# Altium schematic sheet DRIVERS_CONNECTORS.SchDoc: LEDBO - LRTBR98G (Drivers)
size B; Author: Sébastien Gélinas; Organization: SmartHalo; Address1: 5445 de Gaspé; Address2: Montréal, QC; Address3: Canada; Address4: H2T 3B2; Revision: 1; SheetNumber: 1; SheetTotal: 5
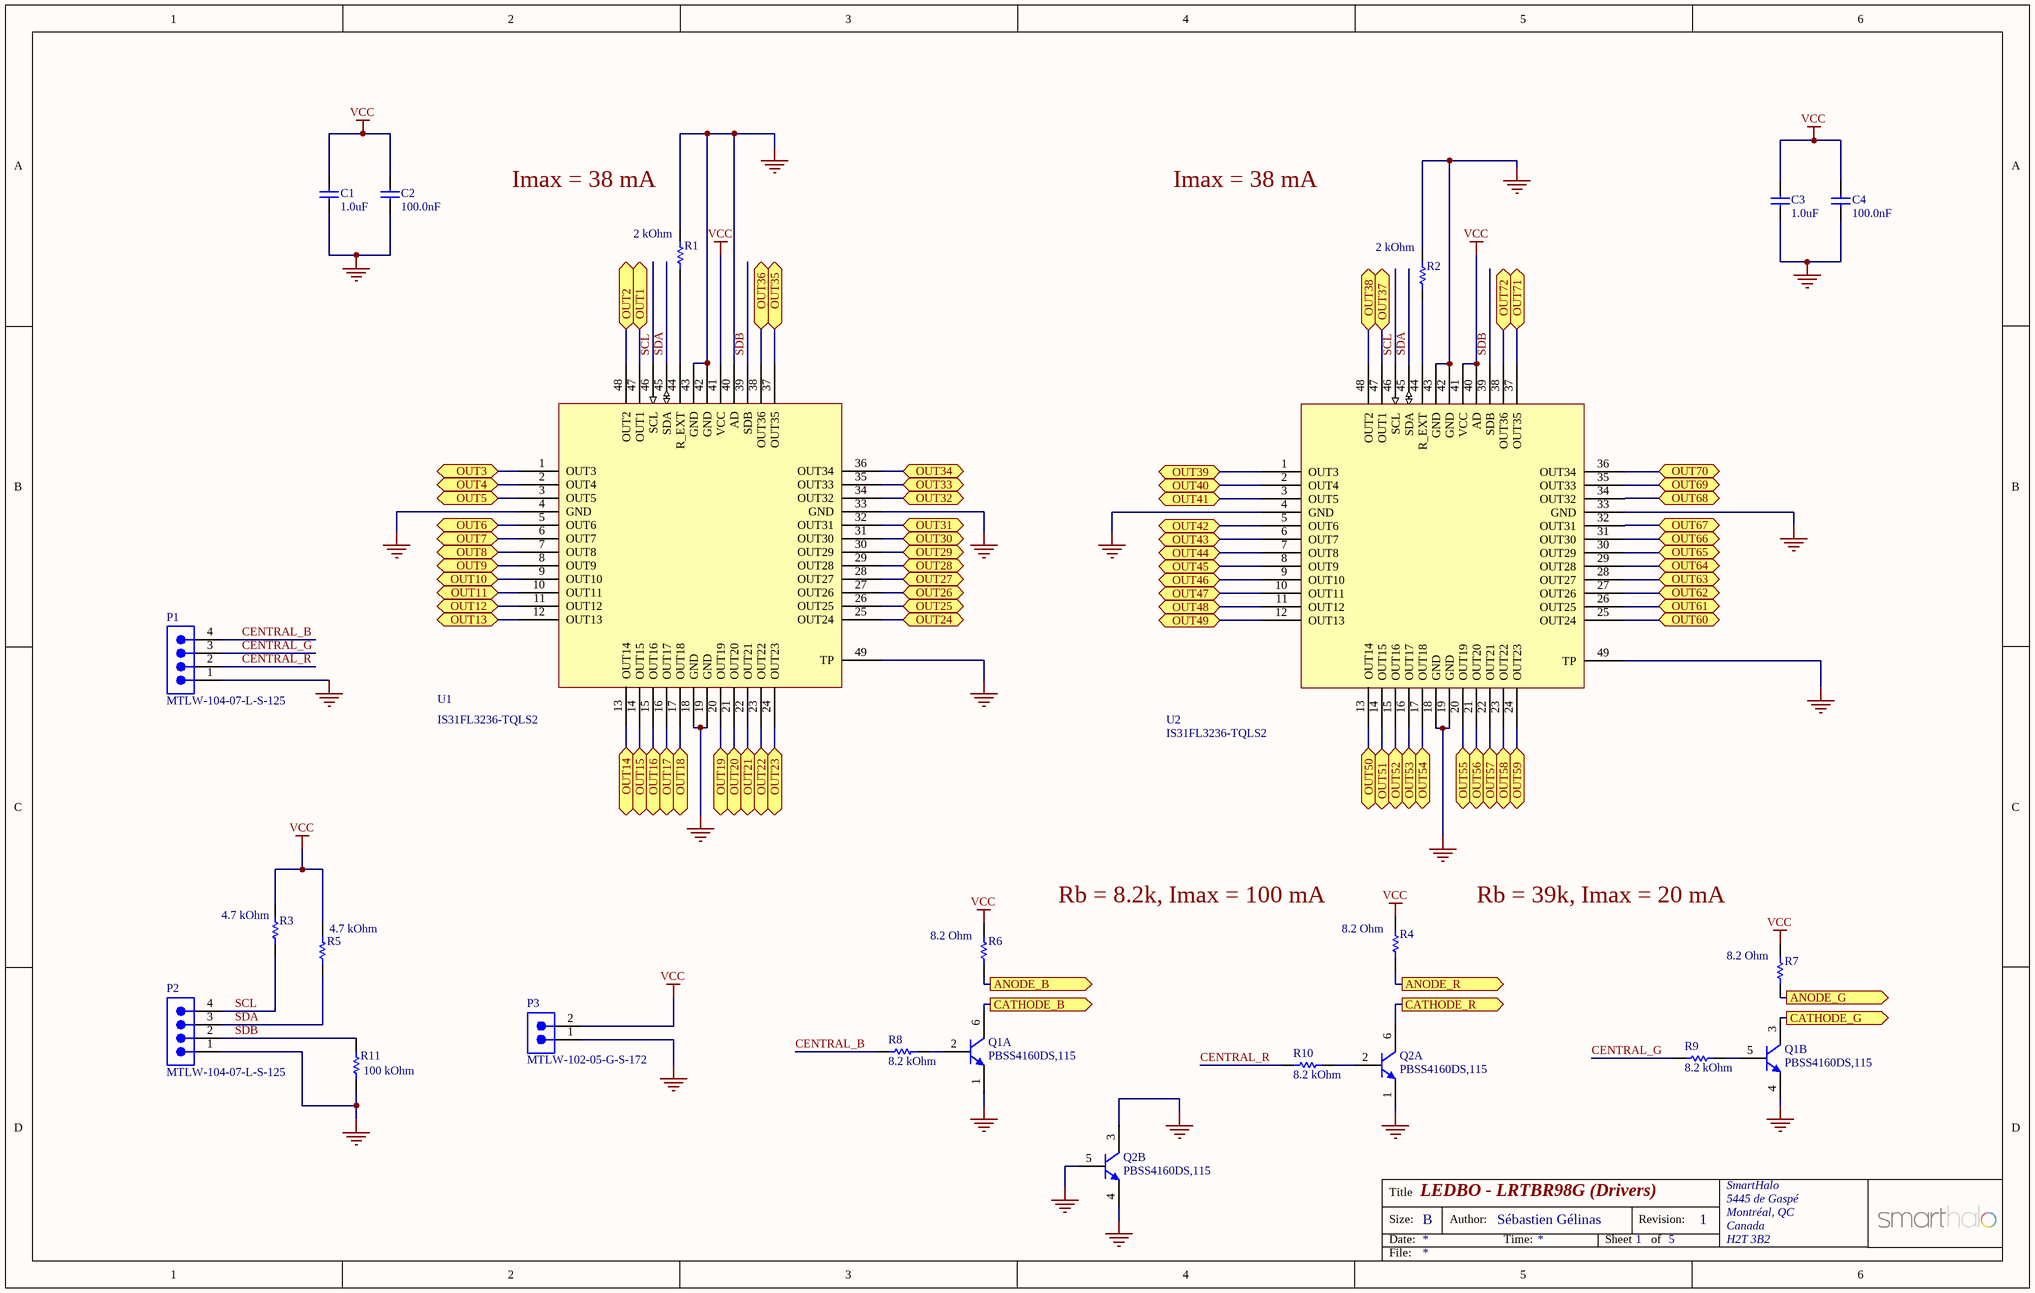
[diagram p0: DRIVERS_CONNECTORS.SchDoc]

## Parts
C1  1.0uF  [CAPC0603(1608)100_N]
C2  100.0nF  [CAPC0603(1608)100_N]
C3  1.0uF  [CAPC0603(1608)100_N]
C4  100.0nF  [CAPC0603(1608)100_N]
P1  MTLW-104-07-L-S-125  [SMTC-MTLW-104-07-X-S-125]  (no BOM)
P2  MTLW-104-07-L-S-125  [SMTC-MTLW-104-07-X-S-125]  (no BOM)
P3  MTLW-102-05-G-S-172  [SMTC-MTLW-102-05-X-S-172]  (no BOM)
Q1  PBSS4160DS,115  [NXP-SC74_M]  (parts A,B of 2)
Q2  PBSS4160DS,115  [NXP-SC74_M]  (parts A,B of 2)
R1  2 kOhm  [RESC0603(1608)_N]
R2  2 kOhm  [RESC0603(1608)_N]
R3  4.7 kOhm  [RESC0603(1608)_N]
R4  8.2 Ohm  [RESC0603(1608)_N]
R5  4.7 kOhm  [RESC0603(1608)_N]
R6  8.2 Ohm  [RESC0603(1608)_N]
R7  8.2 Ohm  [RESC0603(1608)_N]
R8  8.2 kOhm  [RESC0603(1608)_N]
R9  8.2 kOhm  [RESC0603(1608)_N]
R10  8.2 kOhm  [RESC0603(1608)_N]
R11  100 kOhm  [RESC0603(1608)_N]
U1  IS31FL3236-TQLS2  [TQFP48]
U2  IS31FL3236-TQLS2  [TQFP48]

## Ports
ANODE_B (out), ANODE_G (out), ANODE_R (out), CATHODE_B (out), CATHODE_G (out), CATHODE_R (out), OUT1, OUT2, OUT3, OUT4, OUT5, OUT6, OUT7, OUT8, OUT9, OUT10, OUT11, OUT12, OUT13, OUT14, OUT15, OUT16, OUT17, OUT18, OUT19, OUT20, OUT21, OUT22, OUT23, OUT24, OUT25, OUT26, OUT27, OUT28, OUT29, OUT30, OUT31, OUT32, OUT33, OUT34, OUT35, OUT36, OUT37, OUT38, OUT39, OUT40, OUT41, OUT42, OUT43, OUT44, OUT45, OUT46, OUT47, OUT48, OUT49, OUT50, OUT51, OUT52, OUT53, OUT54, OUT55, OUT56, OUT57, OUT58, OUT59, OUT60, OUT61, OUT62, OUT63, OUT64, OUT65, OUT66, OUT67, OUT68, OUT69, OUT70, OUT71, OUT72

## Nets
GND: C1.2 C2.2 C3.2 C4.2 P1.1 P2.1 P3.1 Q1.1(E1) Q1.4(E2) Q2.1(E1) Q2.3(C2) Q2.4(E2) Q2.5(B2) R1.2 R2.2 R11.1 U1.4(GND) U1.18(GND) U1.19(GND) U1.33(GND) U1.40(AD) U1.42(GND) U1.43(GND) U1.49(TP) U2.4(GND) U2.18(GND) U2.19(GND) U2.33(GND) U2.42(GND) U2.43(GND) U2.49(TP)
VCC: C1.1 C2.1 C3.1 C4.1 P3.2 R3.2 R4.2 R5.2 R6.2 R7.2 U1.41(VCC) U2.40(AD) U2.41(VCC)
ANODE_B: R6.1 ; port ANODE_B
ANODE_G: R7.1 ; port ANODE_G
ANODE_R: R4.1 ; port ANODE_R
CATHODE_B: Q1.6(C1) ; port CATHODE_B
CATHODE_G: Q1.3(C2) ; port CATHODE_G
CATHODE_R: Q2.6(C1) ; port CATHODE_R
CENTRAL_B: P1.4 R8.2
CENTRAL_G: P1.3 R9.2
CENTRAL_R: P1.2 R10.2
OUT1: U1.47(OUT1) ; port OUT1
OUT2: U1.48(OUT2) ; port OUT2
OUT3: U1.1(OUT3) ; port OUT3
OUT4: U1.2(OUT4) ; port OUT4
OUT5: U1.3(OUT5) ; port OUT5
OUT6: U1.5(OUT6) ; port OUT6
OUT7: U1.6(OUT7) ; port OUT7
OUT8: U1.7(OUT8) ; port OUT8
OUT9: U1.8(OUT9) ; port OUT9
OUT10: U1.9(OUT10) ; port OUT10
OUT11: U1.10(OUT11) ; port OUT11
OUT12: U1.11(OUT12) ; port OUT12
OUT13: U1.12(OUT13) ; port OUT13
OUT14: U1.13(OUT14) ; port OUT14
OUT15: U1.14(OUT15) ; port OUT15
OUT16: U1.15(OUT16) ; port OUT16
OUT17: U1.16(OUT17) ; port OUT17
OUT18: U1.17(OUT18) ; port OUT18
OUT19: U1.20(OUT19) ; port OUT19
OUT20: U1.21(OUT20) ; port OUT20
OUT21: U1.22(OUT21) ; port OUT21
OUT22: U1.23(OUT22) ; port OUT22
OUT23: U1.24(OUT23) ; port OUT23
OUT24: U1.25(OUT24) ; port OUT24
OUT25: U1.26(OUT25) ; port OUT25
OUT26: U1.27(OUT26) ; port OUT26
OUT27: U1.28(OUT27) ; port OUT27
OUT28: U1.29(OUT28) ; port OUT28
OUT29: U1.30(OUT29) ; port OUT29
OUT30: U1.31(OUT30) ; port OUT30
OUT31: U1.32(OUT31) ; port OUT31
OUT32: U1.34(OUT32) ; port OUT32
OUT33: U1.35(OUT33) ; port OUT33
OUT34: U1.36(OUT34) ; port OUT34
OUT35: U1.37(OUT35) ; port OUT35
OUT36: U1.38(OUT36) ; port OUT36
OUT37: U2.47(OUT1) ; port OUT37
OUT38: U2.48(OUT2) ; port OUT38
OUT39: U2.1(OUT3) ; port OUT39
OUT40: U2.2(OUT4) ; port OUT40
OUT41: U2.3(OUT5) ; port OUT41
OUT42: U2.5(OUT6) ; port OUT42
OUT43: U2.6(OUT7) ; port OUT43
OUT44: U2.7(OUT8) ; port OUT44
OUT45: U2.8(OUT9) ; port OUT45
OUT46: U2.9(OUT10) ; port OUT46
OUT47: U2.10(OUT11) ; port OUT47
OUT48: U2.11(OUT12) ; port OUT48
OUT49: U2.12(OUT13) ; port OUT49
OUT50: U2.13(OUT14) ; port OUT50
OUT51: U2.14(OUT15) ; port OUT51
OUT52: U2.15(OUT16) ; port OUT52
OUT53: U2.16(OUT17) ; port OUT53
OUT54: U2.17(OUT18) ; port OUT54
OUT55: U2.20(OUT19) ; port OUT55
OUT56: U2.21(OUT20) ; port OUT56
OUT57: U2.22(OUT21) ; port OUT57
OUT58: U2.23(OUT22) ; port OUT58
OUT59: U2.24(OUT23) ; port OUT59
OUT60: U2.25(OUT24) ; port OUT60
OUT61: U2.26(OUT25) ; port OUT61
OUT62: U2.27(OUT26) ; port OUT62
OUT63: U2.28(OUT27) ; port OUT63
OUT64: U2.29(OUT28) ; port OUT64
OUT65: U2.30(OUT29) ; port OUT65
OUT66: U2.31(OUT30) ; port OUT66
OUT67: U2.32(OUT31) ; port OUT67
OUT68: U2.34(OUT32) ; port OUT68
OUT69: U2.35(OUT33) ; port OUT69
OUT70: U2.36(OUT34) ; port OUT70
OUT71: U2.37(OUT35) ; port OUT71
OUT72: U2.38(OUT36) ; port OUT72
SCL: P2.4 R3.1 U1.46(SCL) U2.46(SCL)
SDA: P2.3 R5.1 U1.45(SDA) U2.45(SDA)
SDB: P2.2 R11.2 U1.39(SDB) U2.39(SDB)
NetQ1_2: Q1.2(B1) R8.1
NetQ1_5: Q1.5(B2) R9.1
NetQ2_2: Q2.2(B1) R10.1
NetR1_1: R1.1 U1.44(R_EXT)
NetR2_1: R2.1 U2.44(R_EXT)

## Notes on the sheet
- (near R1) Imax = 38 mA
- Imax = 38 mA
- Rb = 8.2k, Imax = 100 mA
- Rb = 39k, Imax = 20 mA
- Title
- Size:
- Date:
- B
- Author:
- Time:
- Sheet
- Revision:
- of
- File:

## Library data of the parts
C1-C4 = CAP0603: Chip Cap 0603 X7R 10%; Part Number: C0402-1n0; Note: Chip Cap X7R 10%; Artikkelnr Noca: 20039223; Published: 2009-05-08; LatestRevisionDate: 2009-11-23; Publisher: Nordic Semiconductor; Manufacturer: *; Manufacturer Part Number: *; Datasheet: *; Footprint: 0603; Pin Count: 2; Supplier: *
  C1 C3: Value: 1.0uF
  C2 C4: Value: 100.0nF
P1 P2 = CMP-1024-00072-1: Low Profile .025" SQ Post Header, Through-hole, Vertical, -55 to 125 degC, 2.54 mm Pitch, 4-Pin, Male, RoHS; Manufacturer: Samtec; Pitch: 2.54 mm; PackageDescription: Low Profile Terminal Assembly; PartNumber: MTLW-104-07-L-S-125; PackageReference: MTLW-104-07-X-S-125; ComponentLink1Description: Manufacturer URL; ComponentLink2Description: Datasheet; ComponentLink2URL: http://www.samtec.com/documents/webfiles/pdf/MTLW_TH.PDF; ComponentLink3Description: Package Specification; Mounting Technology: Through-hole; ComponentLink3URL: http://www.samtec.com/documents/webfiles/cpdf/MTLW-1XX-XX-XX-X-XXX-XX-XX-MKT1.pdf; ComponentLink1URL: http://www.samtec.com; Orientation: Vertical; PackageVersion: T, 6/1991; DatasheetVersion: F-214; Temperature Range: -55 to 125 degC; RoHS: True
P3 = CMP-1024-00064-1: Low Profile .025" SQ Post Header, Through-hole, Vertical, -55 to 125 degC, 2.54 mm Pitch, 2-Pin, Male, RoHS; Manufacturer: Samtec; Pitch: 2.54 mm; ComponentLink2URL: http://www.samtec.com/documents/webfiles/pdf/MTLW_TH.PDF; PackageDescription: Low Profile Terminal Assembly; ComponentLink3URL: http://www.samtec.com/documents/webfiles/cpdf/MTLW-1XX-XX-XX-X-XXX-XX-XX-MKT1.pdf; PackageReference: MTLW-102-05-X-S-172; Mounting Technology: Through-hole; ComponentLink2Description: Datasheet; PackageVersion: T, 6/1991; Orientation: Vertical; DatasheetVersion: F-214; RoHS: True; ComponentLink3Description: Package Specification; ComponentLink1URL: http://www.samtec.com; Temperature Range: -55 to 125 degC; PartNumber: MTLW-102-05-G-S-172; ComponentLink1Description: Manufacturer URL
Q1 Q2 = PBSS4160DS,115: TRANS 2NPN 60V 1A 6TSOP; Manufacturer: NXP Semiconductors; Polarity: NPN; Mounting Technology: Surface Mount; PackageDescription: 6-Pin Semiconductor Package, 2.9 x 1.6 mm Body, 0.95 mm Pitch; PackageReference: SC74; PartNumber: PBSS4160DS; Manufacturer Part Number: PBSS4160DS,115; Digi-Key Part Number: 568-4350-1-ND
R1 R2 = CMP-1012-00090-1: 2k 0.1W 5% 0603 (1608 Metric)  SMD; Case-Metric: 1608; Case-EIA: 0603; Tolerance: 5 %; Technology: SMT; Power: 0.1 W; Value: 2 kOhm
R3 R5 = CMP-1012-00090-1: 4K7 0.1W 5% 0603 (1608 Metric)  SMD; Case-Metric: 1608; Case-EIA: 0603; Tolerance: 5 %; Technology: SMT; Power: 0.1 W; Value: 4.7 kOhm
R4 R6 R7 = CMP-1012-00090-1: 8R2 0.1W 5% 0603 (1608 Metric)  SMD; Case-Metric: 1608; Case-EIA: 0603; Tolerance: 5 %; Technology: SMT; Power: 0.1 W; Value: 8.2 Ohm
R8-R10 = CMP-1012-00090-1: 8K2 0.1W 5% 0603 (1608 Metric)  SMD; Case-Metric: 1608; Case-EIA: 0603; Tolerance: 5 %; Technology: SMT; Power: 0.1 W; Value: 8.2 kOhm
R11 = CMP-1012-00090-1: 100k 0.1W 5% 0603 (1608 Metric)  SMD; Case-Metric: 1608; Case-EIA: 0603; Tolerance: 5 %; Technology: SMT; Power: 0.1 W; Value: 100 kOhm
U1 U2 = IS31FL3236-TQLS2: IC 36 CHANNELS LED DRIVER; Manufacturer: ISSI; Manufacturer Part Number: IS31FL3236-TQLS2